# EAGLE design MSlave (EAGLE 6.5.0)
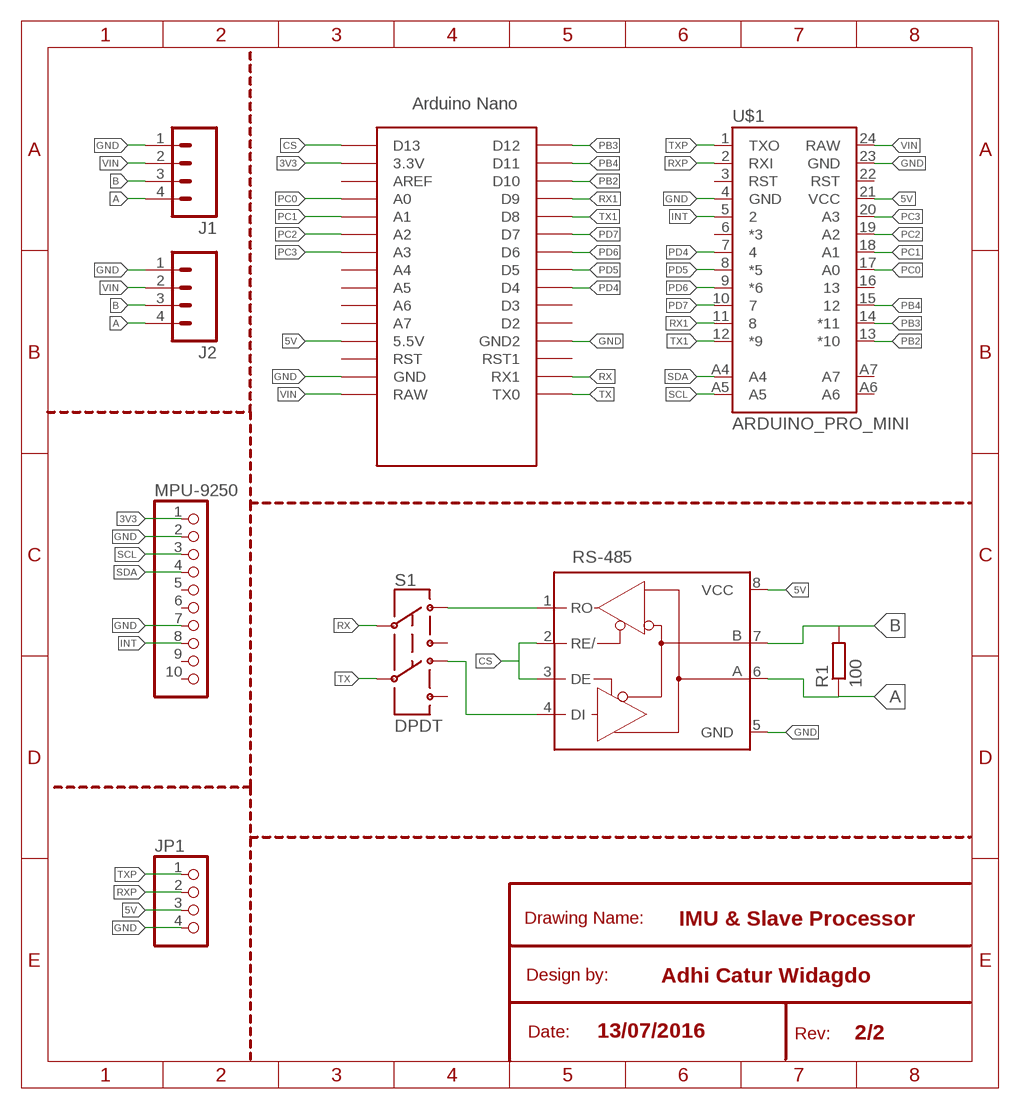
[diagram p0: schematic, sheet 1]

## Parts
J1  M04POLAR  [MOLEX-1X4]
J2  M04POLAR  [MOLEX-1X4]
JP1  PINHD-1X4  [1X04]
MCU_SLAVE  MCU_Slave  NANO  [NANO]
MPU-9250  PINHD-1X10  [1X10]
R1  100  R-EU_0204/7  [0204/7]
RS-485  MAX3468CPA  [DIL08]
S1  DPDT  SWITCH-DPDTAYZ0202  [AYZ0202]
U$1  ARDUINO_PRO_MINI  [ARDUINO_PRO_MINI]

## Nets
3V3: MCU_SLAVE.3.3V MPU-9250.1
5V: JP1.3 MCU_SLAVE.5V(5.5V) RS-485.8(VCC) U$1.21(VCC)
A: J1.4 J2.4 R1.1 RS-485.6(A)
B: J1.3 J2.3 R1.2 RS-485.7(B)
CS: MCU_SLAVE.D13 RS-485.2(RE/) RS-485.3(DE)
GND: J1.1 J2.1 JP1.4 MCU_SLAVE.GND MCU_SLAVE.GND1(GND2) MPU-9250.2 MPU-9250.7 RS-485.5(GND) U$1.4(GND) U$1.23(GND)
INT: MPU-9250.8 U$1.5
N$1: RS-485.1(RO) S1.1
N$2: RS-485.4(DI) S1.4
PB2: MCU_SLAVE.D10 U$1.13(*10)
PB3: MCU_SLAVE.D12 U$1.14(*11)
PB4: MCU_SLAVE.D11 U$1.15
PC0: MCU_SLAVE.A0 U$1.17(A0)
PC1: MCU_SLAVE.A1 U$1.18(A1)
PC2: MCU_SLAVE.A2 U$1.19(A2)
PC3: MCU_SLAVE.A3 U$1.20(A3)
PD4: MCU_SLAVE.D4 U$1.7
PD5: MCU_SLAVE.D5 U$1.8(*5)
PD6: MCU_SLAVE.D6 U$1.9(*6)
PD7: MCU_SLAVE.D7 U$1.10
RX: MCU_SLAVE.RX1 S1.2
RX1: MCU_SLAVE.D9 U$1.11
RXP: JP1.2 U$1.2(RXI)
SCL: MPU-9250.3 U$1.A5
SDA: MPU-9250.4 U$1.A4
TX: MCU_SLAVE.TX0 S1.5
TX1: MCU_SLAVE.D8 U$1.12(*9)
TXP: JP1.1 U$1.1(TXO)
VIN: J1.2 J2.2 MCU_SLAVE.RAW U$1.24(RAW)
Unconnected: MCU_SLAVE.A4 MCU_SLAVE.A5 MCU_SLAVE.A6 MCU_SLAVE.A7 MCU_SLAVE.AREF MCU_SLAVE.D2 MCU_SLAVE.D3 MCU_SLAVE.ICSP1 MCU_SLAVE.ICSP2 MCU_SLAVE.ICSP3 MCU_SLAVE.ICSP4 MCU_SLAVE.ICSP5 MCU_SLAVE.ICSP6 MCU_SLAVE.RST MCU_SLAVE.RST1 MPU-9250.5 MPU-9250.6 MPU-9250.9 MPU-9250.10 S1.3 S1.6 U$1.3(RST) U$1.6(*3) U$1.16 U$1.22(RST) U$1.A6 U$1.A7

## Notes on the sheet
- Drawing Name: | IMU & Slave Processor
- Design by: | Adhi Catur Widagdo
- Date: | 13/07/2016 | Rev: | 2/2

## Library data of the parts
J1 J2 = SparkFun-Connectors:M04: Header 4 Standard 4-pin 0.1" header. Use with straight break away headers (SKU : PRT-00116), right angle break away headers (PRT-00553), swiss pins (PRT-00743), machine pins (PRT-00117), and female headers (PRT-00115). Molex polarized connector foot print use with SKU : PRT-08231 with associated crimp pins and housings. 1MM SMD Version SKU: PRT-10208
JP1 = pinhead:PINHD-1X4: PIN HEADER
MCU_SLAVE = Arduino-clone:NANO: Arduino Nano
MPU-9250 = pinhead:PINHD-1X10: PIN HEADER
R1 = rcl:R-EU_: RESISTOR, European symbol
RS-485 = maxim:MAX34*: +5V, Fail-Safe, 40Mbps, Profibus RS-485/RS-422 Transceivers Source: MAX3465-MAX3469.pdf; OC_FARNELL: unknown; OC_NEWARK: unknown
S1 = SparkFun-Electromechanical:SWITCH-DPDT: DPDT Version of the COM-00597; PROD_ID: SWCH-08179
U$1 = SparkFun-Boards:ARDUINO_PRO_MINI

## Board
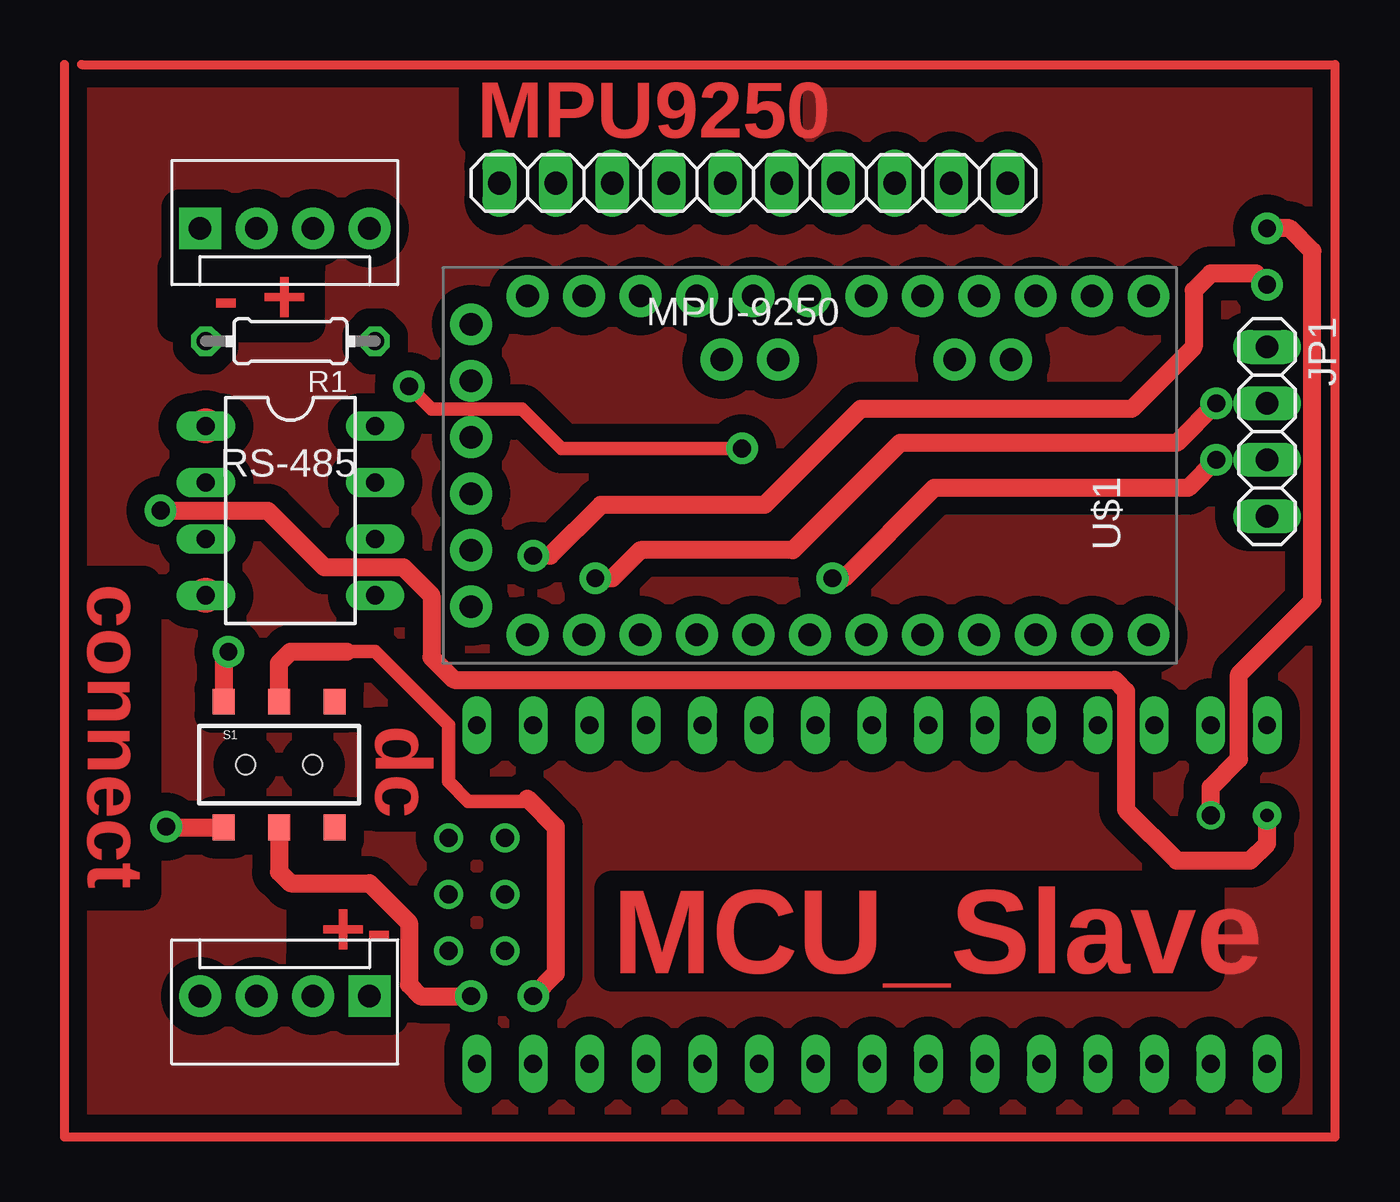
[diagram p1: board, top side]
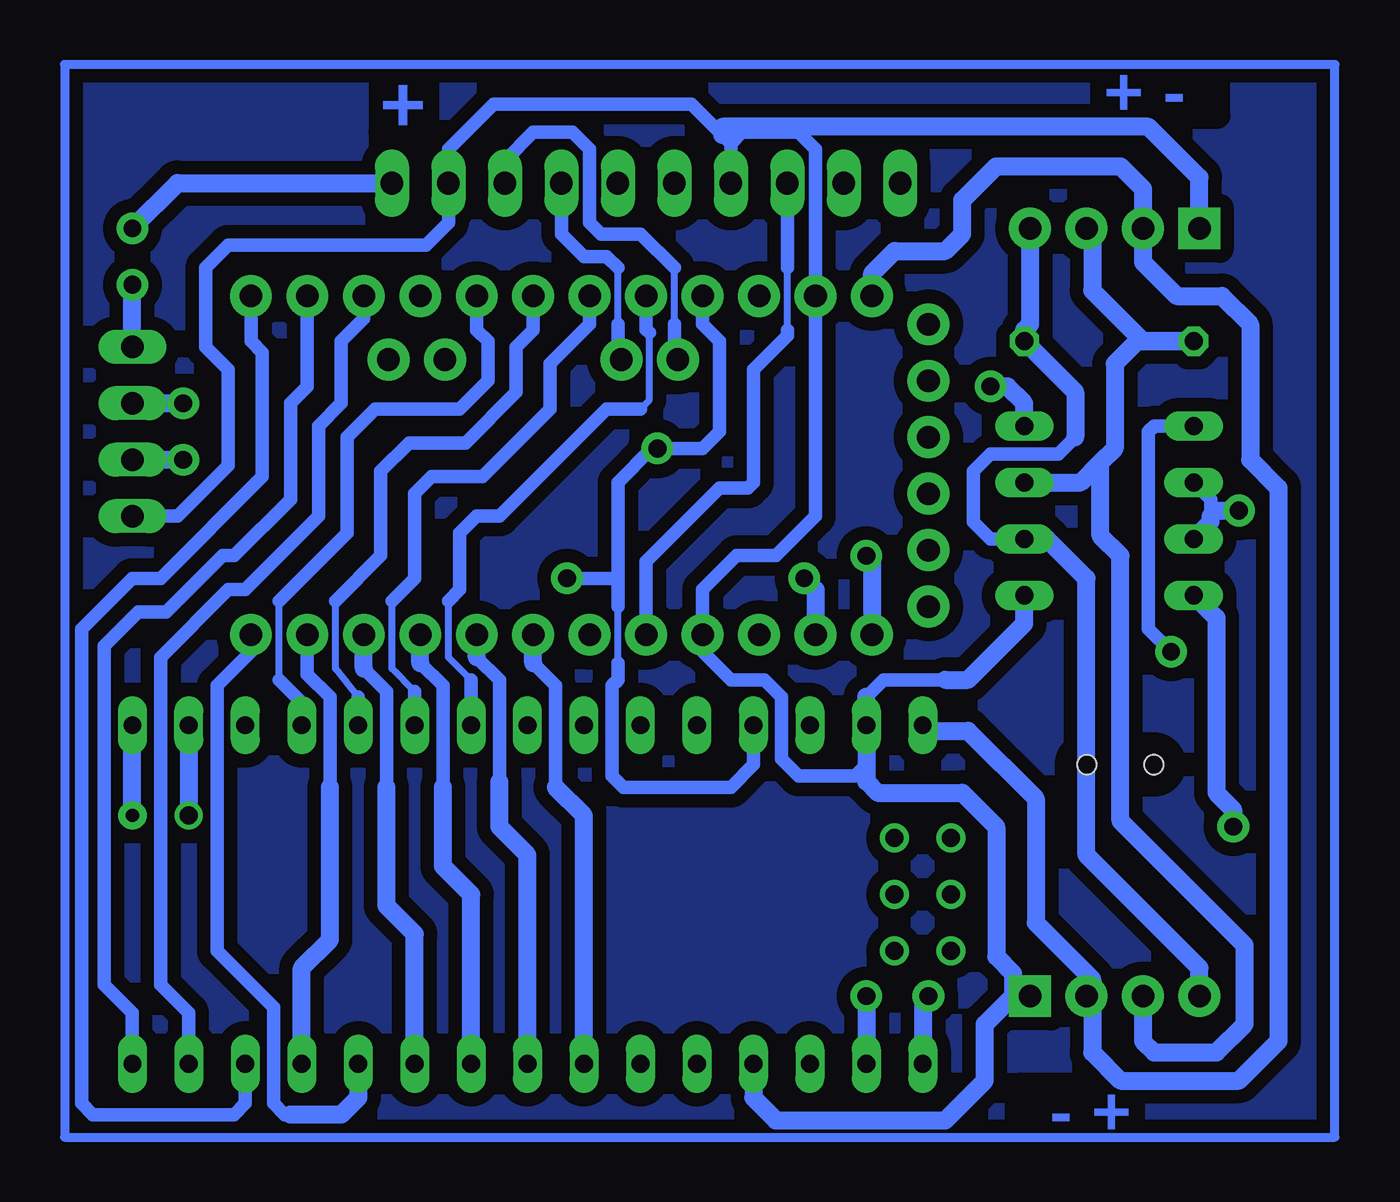
[diagram p2: board, bottom side, seen from below]

No outline drawn. Coordinates in mm, seen from the top.
Copper layers (1*16): Top 0.035mm / dielectric 1.5mm / Bottom 0.035mm
Design rules "default": minimum track width 10mil, minimum drill 24mil, track to track 8mil, track to pad 8mil, pad to pad 8mil, via to via 8mil, smd to smd 8mil, copper to edge 40mil, drill to drill 8mil, minimum pad ring 10mil, minimum via ring 8mil, stop-mask expansion 4mil, vias tented up to drill 0mil, thermal gap 10mil

### Footprints (pad centres in the part's own frame; a part is rotated, then mirrored left to right if it is on the bottom)
MOLEX-1X4 = drill 1.016 pad 1.88 square: 1 0,0 | drill 1.016 pad 1.88: 2 2.54,0; 3 5.08,0; 4 7.62,0
1X04 = drill 1.016 long: 1 -3.81,0; 2 -1.27,0; 3 1.27,0; 4 3.81,0
NANO = drill 0.8 long: 3.3V -10.16,24.13; 5V -10.16,-1.27; A0 -10.16,19.05; A1 -10.16,16.51; A2 -10.16,13.97; A3 -10.16,11.43; A4 -10.16,8.89; A5 -10.16,6.35; A6 -10.16,3.81; A7 -10.16,1.27; AREF -10.16,21.59; D2 5.08,1.27; D3 5.08,3.81; D4 5.08,6.35; D5 5.08,8.89; D6 5.08,11.43; D7 5.08,13.97; D8 5.08,16.51; D9 5.08,19.05; D10 5.08,21.59; D11 5.08,24.13; D12 5.08,26.67; D13 -10.16,26.67; GND -10.16,-6.35; GND1 5.08,-1.27; RAW -10.16,-8.89; RST -10.16,-3.81; RST1 5.08,-3.81; RX1 5.08,-6.35; TX0 5.08,-8.89 | drill 0.8: ICSP1 -5.08,-10.16; ICSP2 -5.08,-7.62; ICSP3 -2.54,-10.16; ICSP4 -2.54,-7.62; ICSP5 0,-10.16; ICSP6 0,-7.62
1X10 = drill 1.016 long: 1 -11.43,0; 2 -8.89,0; 3 -6.35,0; 4 -3.81,0; 5 -1.27,0; 6 1.27,0; 7 3.81,0; 8 6.35,0; 9 8.89,0; 10 11.43,0
0204/7 = drill 0.813 octagon: 1 -3.81,0; 2 3.81,0
DIL08 = drill 0.813 long: 1 -3.81,-3.81; 2 -1.27,-3.81; 3 1.27,-3.81; 4 3.81,-3.81; 5 3.81,3.81; 6 1.27,3.81; 7 -1.27,3.81; 8 -3.81,3.81
AYZ0202 = smd 1 x 1.15: 1 -2.5,2.825; 2 0,2.825; 3 2.5,2.825; 4 -2.5,-2.825; 5 0,-2.825; 6 2.5,-2.825 | hole 0.85: 1.5,0; -1.5,0
ARDUINO_PRO_MINI = drill 1.016 pad 1.88: 1 -7.62,12.7; 2 -7.62,10.16; 3 -7.62,7.62; 4 -7.62,5.08; 5 -7.62,2.54; 6 -7.62,0; 7 -7.62,-2.54; 8 -7.62,-5.08; 9 -7.62,-7.62; 10 -7.62,-10.16; 11 -7.62,-12.7; 12 -7.62,-15.24; 13 7.62,-15.24; 14 7.62,-12.7; 15 7.62,-10.16; 16 7.62,-7.62; 17 7.62,-5.08; 18 7.62,-2.54; 19 7.62,0; 20 7.62,2.54; 21 7.62,5.08; 22 7.62,7.62; 23 7.62,10.16; 24 7.62,12.7; A4 4.763,1.429; A5 4.763,3.969; A6 4.763,-9.049; A7 4.763,-6.509; BLK -6.35,15.24; GND -3.81,15.24; GRN 6.35,15.24; RXI 1.27,15.24; TXO 3.81,15.24; VCC -1.27,15.24

### Placement (x,y rotation side)
J1  14.22,7.62 180 top
J2  6.6,42.16 0 top
JP1  54.61,33.02 270 top
MCU_SLAVE  27.94,9.65 270 top
MPU-9250  31.5,44.2 180 top
R1  10.67,37.08 180 top
RS-485  10.67,29.46 270 top
S1  10.16,18.03 0 top
U$1  34.04,31.5 90 top

### Tracks (layer width: path | path; a pad name or v marks a point on that pad's centre or on a via)
3V3  (via drill 0.8 pad 1.27, 0.8 pad 1.42)
  Top 0.813: v52.07,15.75 52.07,17.02 53.34,18.29 53.34,22.1 56.64,25.4 56.64,41.15 55.63,42.16 v54.61,42.16
  Bottom 0.813: MCU_SLAVE.3.3V v52.07,15.75 | v54.61,42.16 52.58,44.2 MPU-9250.1
5V  (via drill 0.8 pad 1.42)
  Top 0.61: v16,35.05 17.02,34.04 21.08,34.04 22.86,32.26 v30.99,32.26
  Top 0.813: v52.32,31.75 51.05,30.48 39.62,30.48 35.56,26.42 v35.05,26.42
  Bottom 0.305: 32.77,22.61 32.77,25.15
  Bottom 0.61: 32.77,25.15 32.77,26.42 | 32.77,26.42 32.77,30.73 31.24,32.26 v30.99,32.26 28.96,32.26 28.19,33.02 28.19,37.08 28.96,37.85 U$1.21 | MCU_SLAVE.5V 26.67,18.03 27.69,17.02 32.51,17.02 33.02,17.53 33.02,21.59 32.77,21.84 32.77,22.61 | v35.05,26.42 32.77,26.42
  Bottom 0.813: RS-485.8 14.48,34.29 15.24,35.05 v16,35.05 | JP1.3 v52.32,31.75
A
  Bottom 0.61: 12.19,32.77 12.95,32 16,32 16.76,31.24 16.76,28.96 16,28.19 RS-485.6
  Bottom 0.813: J2.4 14.22,37.85 14.48,37.59 R1.1 12.19,34.8 12.19,32.77 | RS-485.6 13.46,28.19 11.68,26.42 11.68,13.97 6.6,8.89 J1.4
B
  Bottom 0.813: RS-485.7 11.94,30.73 11.05,31.62 | J1.3 9.14,5.59 8.64,5.08 5.84,5.08 4.57,6.35 4.57,9.91 10.16,15.49 10.16,27.43 11.05,28.32 11.05,31.62 | J2.3 11.43,41.91 11.43,39.37 9.14,37.08 R1.2 9.4,37.08 10.41,36.07 10.41,32.26 11.05,31.62
CS  (via drill 0.6 pad 1.27, 0.8 pad 1.42)
  Top 0.813: v4.83,29.46 9.65,29.46 12.19,26.92 15.75,26.92 17.02,25.65 17.02,22.86 18.03,21.84 47.75,21.84 48.26,21.34 48.26,16 50.55,13.72 53.85,13.72 54.61,14.48 v54.61,15.75
  Bottom 0.61: RS-485.2 6.1,29.97 6.1,29.21 6.1,28.45 6.35,28.19 RS-485.3
  Bottom 0.813: RS-485.3 6.1,28.96 6.1,29.21 5.84,29.46 v4.83,29.46 | v54.61,15.75 MCU_SLAVE.D13
GND
  Bottom 0.61: MCU_SLAVE.GND 21.59,18.03 22.1,17.53 24.64,17.53 25.4,18.29 25.4,21.08 26.16,21.84 27.69,21.84 28.96,23.11 U$1.4 28.96,25.91 27.43,27.43 25.65,27.43 23.88,29.21 U$1.23 23.88,45.72 24.64,46.48 27.18,46.48 27.69,45.97 | MPU-9250.7 27.69,45.97 | 27.69,45.97 28.07,46.35 29.46,47.75 38.35,47.75 40.39,45.72 MPU-9250.2 40.39,42.42 41.4,41.4 50.29,41.4 51.31,40.39 51.31,36.83 50.29,35.81 50.29,31.5 52.58,29.21 JP1.4 | 21.59,21.08 20.83,21.84 18.03,21.84
  Bottom 0.813: MCU_SLAVE.GND1 26.67,3.05 25.65,2.03 18.03,2.03 16.26,3.81 16.26,6.35 14.99,7.62 | 14.99,7.62 J1.1 | 14.99,7.62 14.99,8.64 15.75,9.4 15.75,15.24 17.27,16.76 21.08,16.76 21.59,17.27 MCU_SLAVE.GND 21.59,21.08 | J2.1 6.6,44.45 8.89,46.74 28.07,46.74 28.07,46.35 | 18.03,21.84 17.02,21.84 14.48,24.38 RS-485.5
INT
  Bottom 0.305: 25.15,37.59 25.15,40.39
  Bottom 0.61: U$1.5 31.5,27.18 28.19,30.48 26.92,30.48 26.67,30.73 26.67,35.81 25.15,37.34 25.15,37.59 | 25.15,40.39 MPU-9250.8
N$1  (via drill 0.8 pad 1.42)
  Top 0.813: v7.87,23.11 7.66,22.9 S1.1
  Bottom 0.61: RS-485.1 8.64,33.27 8.89,33.02 8.89,24.13 v7.87,23.11
N$2  (via drill 0.8 pad 1.42)
  Top 0.813: v5.08,15.24 5.11,15.21 S1.4
  Bottom 0.813: RS-485.4 5.84,24.64 5.84,16.76 5.08,16 v5.08,15.24
N$3
  pour Bottom (isolate 0.61): 0.51,49.53 57.66,49.53 57.66,1.27 0.51,1.27
N$4
  pour Top (isolate 0.813): 0.51,49.53 57.66,49.53 57.66,1.27 0.51,1.27
N$5
  Top 0.406: 1.27,49.53 57.66,49.53 57.66,1.27 0.51,1.27 0.51,49.53
N$6
  Bottom 0.406: 0.51,49.53 57.66,49.53 57.66,1.27 0.51,1.27 0.51,49.53
PB2
  Bottom 0.61: MCU_SLAVE.D10 49.53,2.79 50.04,2.29 56.39,2.29 56.9,2.79 56.9,24.13 54.61,26.42 53.34,26.42 48.77,30.99 48.77,36.58 49.28,37.08 49.28,38.1 49.28,38.61 U$1.13
PB3
  Bottom 0.61: MCU_SLAVE.D12 54.61,6.86 55.88,8.13 55.88,23.37 54.36,24.89 53.09,24.89 50.55,27.43 50.04,27.43 47.5,29.97 47.5,34.29 46.74,35.05 U$1.14
PB4
  Bottom 0.61: MCU_SLAVE.D11 52.07,6.86 53.34,8.13 53.34,22.86 50.29,25.91 49.53,25.91 46.23,29.21 46.23,33.27 45.21,34.29 45.21,37.08 44.2,38.1 U$1.15 44.2,38.35
PC0
  Bottom 0.305: 48.01,21.84 48.01,25.4
  Bottom 0.61: MCU_SLAVE.A0 46.99,20.83 48.01,21.84 | 48.01,25.4 44.96,28.45 44.96,32.77 43.69,34.04 39.88,34.04 38.61,35.31 38.61,37.08 39.12,37.59 U$1.17
PC1
  Bottom 0.305: 44.45,21.08 45.47,22.35 45.47,25.4
  Bottom 0.61: MCU_SLAVE.A1 44.45,21.08 | 45.47,25.4 43.43,27.43 43.43,31.24 42.16,32.51 39.62,32.51 37.34,34.8 37.34,36.83 36.58,37.59 U$1.18
PC2
  Bottom 0.305: 41.91,21.34 42.93,22.35 42.93,25.4
  Bottom 0.61: MCU_SLAVE.A2 41.91,21.34 | 42.93,25.4 41.91,26.42 41.91,30.23 41.15,30.99 38.86,30.99 35.81,34.04 35.81,36.07 34.04,37.85 U$1.19
PC3
  Bottom 0.305: 39.37,21.84 40.39,22.86 40.39,25.4 | 31.75,34.04 31.34,34.44 31.34,37.47
  Bottom 0.61: MCU_SLAVE.A3 39.37,21.84 | 40.39,25.4 39.88,25.91 39.88,28.45 39.12,29.21 38.1,29.21 33.27,34.04 31.75,34.04 | 31.34,37.47 31.5,37.62 U$1.20
PD4
  Bottom 0.61: 35.56,17.02 35.56,21.59 36.58,22.61
  Bottom 0.813: MCU_SLAVE.D4 34.29,15.75 35.56,17.02 | 36.58,22.61 U$1.7
PD5
  Bottom 0.61: 38.1,17.27 38.1,21.84 39.12,22.86
  Bottom 0.813: MCU_SLAVE.D5 36.83,13.97 38.1,15.24 38.1,17.27 | 39.12,22.86 U$1.8
PD6
  Bottom 0.61: 40.64,17.02 40.64,21.59 41.66,22.61
  Bottom 0.813: MCU_SLAVE.D6 39.37,12.19 40.64,13.46 40.64,17.02 | 41.66,22.61 U$1.9
PD7
  Bottom 0.61: 43.18,17.02 43.18,21.34 44.2,22.35
  Bottom 0.813: MCU_SLAVE.D7 41.91,10.41 43.18,11.68 43.18,17.02 | 44.2,22.35 U$1.10
RX  (via drill 0.8 pad 1.42)
  Top 0.61: 13.21,23.11 14.48,23.11 17.78,19.81 17.78,17.27 18.67,16.38 21.46,16.38
  Top 0.813: S1.2 10.16,22.61 10.67,23.11 13.21,23.11 | 21.34,16.51 21.46,16.38 22.61,15.24 22.61,8.64 v21.59,7.62
  Bottom 0.813: v21.59,7.62 MCU_SLAVE.RX1
RX1
  Bottom 0.61: 46.74,23.37 U$1.11 46.74,22.1 45.72,21.08 45.72,17.02
  Bottom 0.813: MCU_SLAVE.D9 46.99,8.89 45.72,10.16 45.72,17.02
RXP  (via drill 0.8 pad 1.42)
  Top 0.813: v52.32,34.29 50.55,32.51 38.1,32.51 33.27,27.69 26.42,27.69 25.15,26.42 v24.38,26.42
  Bottom 0.813: JP1.2 v52.32,34.29 | v24.38,26.42 23.88,25.91 U$1.2
SCL
  Bottom 0.305: 30.23,37.85 30.23,40.39
  Bottom 0.61: U$1.A5 30.23,36.42 30.23,37.85 | 30.23,40.39 31.75,41.91 33.53,41.91 34.04,42.42 34.04,45.72 34.8,46.48 36.58,46.48 37.85,45.21 MPU-9250.3
SDA
  Bottom 0.305: 32.77,37.85 32.77,40.39
  Bottom 0.61: U$1.A4 32.77,36.42 32.77,37.85 | 32.77,40.39 33.27,40.89 34.29,40.89 35.31,41.91 MPU-9250.4
TX  (via drill 0.8 pad 1.42)
  Top 0.813: S1.5 10.16,13.21 10.67,12.7 14.22,12.7 16,10.92 16,8.13 16.51,7.62 v18.8,7.62
  Bottom 0.813: v18.8,7.62 19.05,7.37 MCU_SLAVE.TX0
TX1
  Bottom 0.61: 47.5,2.29 47.75,2.29 48.26,2.79 48.26,7.11 50.8,9.65 50.8,21.59 49.28,23.11 U$1.12
  Bottom 0.813: MCU_SLAVE.D8 44.45,3.05 45.21,2.29 47.5,2.29
TXP  (via drill 0.8 pad 1.42)
  Top 0.813: v54.61,39.62 54.1,40.13 52.07,40.13 51.31,39.37 51.31,36.83 48.51,34.04 36.32,34.04 32,29.72 24.64,29.72 22.35,27.43 v21.59,27.43
  Bottom 0.813: JP1.1 v54.61,39.62 | v21.59,27.43 21.34,27.18 U$1.1
VIN
  Bottom 0.813: MCU_SLAVE.RAW 18.8,19.56 17.02,19.56 13.97,16.51 13.97,10.92 11.68,8.64 | 11.68,8.64 J1.2 | U$1.24 21.34,40.13 20.32,41.15 18.03,41.15 17.27,41.91 17.27,43.43 15.75,44.96 10.16,44.96 9.14,43.94 J2.2 9.14,40.64 7.62,39.12 5.59,39.12 4.32,37.85 4.32,31.75 3.05,30.48 3.05,5.59 4.83,3.81 10.16,3.81 11.43,5.08 11.43,8.38 11.68,8.64
(copper drawn outside any net)
  shapes: Top circle x2

### Text on the board
Top: MPU9250 | - + | connect | dc | +- | MCU_Slave
Bottom: + | + - | - +